# EAGLE design ComponentTester (EAGLE 9.6.2)
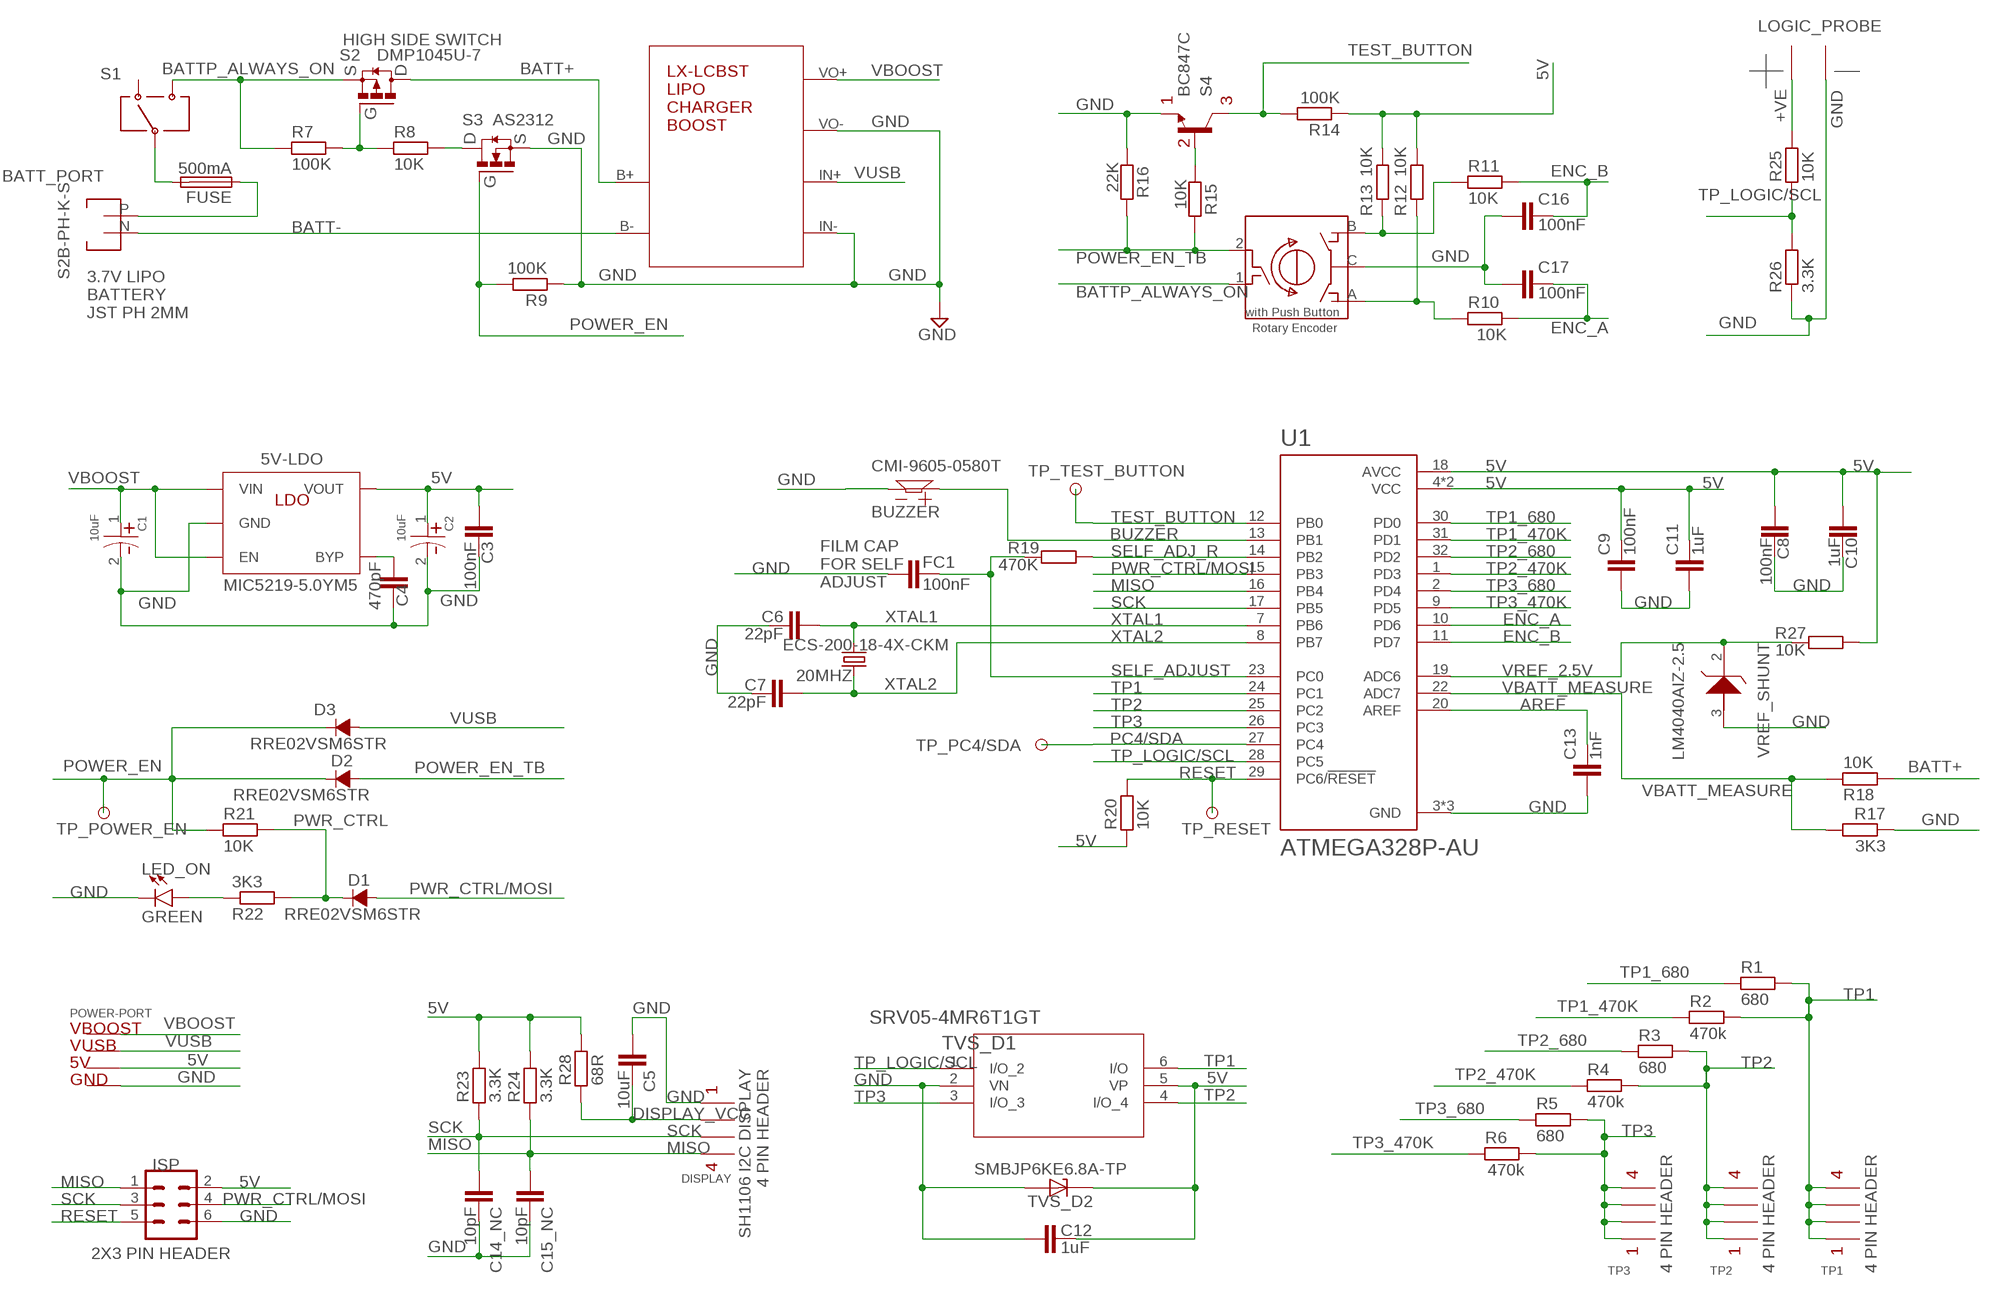
[diagram p0: schematic, sheet 1]

## Parts
5V-LDO  MIC5219-5.0YM5  [SOT-23-5]
20MHZ  ECS-200-18-4X-CKM  [XTAL_ECS-200-18-4X-CKM]
BATT_PORT  S2B-PH-K-S  [S2B-PH-K-S]
BUZZER  CMI-9605-0580T  BUZZER_CMI-9605-0580T  [BUZZER_CMI-9605-0580T]
C1  10uF  CAPACITOR_TANTALUM_SMD1206  [1206_DIRECTED]
C2  10uF  CAPACITOR_TANTALUM_SMD1206  [1206_DIRECTED]
C3  100nF  CAPACITOR_SMD0603  [0603]
C4  470pF  CAPACITOR_SMD0603  [0603]
C5  10uF  CAPACITOR_SMD0603  [0603]
C6  22pF  CAPACITOR_SMD0603  [0603]
C7  22pF  CAPACITOR_SMD0603  [0603]
C8  100nF  CAPACITOR_SMD1206  [1206]
C9  100nF  CAPACITOR_SMD1206  [1206]
C10  1uF  CAPACITOR_SMD1206  [1206]
C11  1uF  CAPACITOR_SMD1206  [1206]
C12  1uF  CAPACITOR_SMD0603  [0603]
C13  1nF  CAPACITOR_SMD0603  [0603]
C14_NC  10pF  CAPACITOR_SMD0603  [0603]
C15_NC  10pF  CAPACITOR_SMD0603  [0603]
C16  100nF  CAPACITOR_SMD0603  [0603]
C17  100nF  CAPACITOR_SMD0603  [0603]
CHARGE_BOOST  LX-LCBST_LIPO_CHARGER_BOOST  [LX-LCBST_LIPO_CHARGER_BOOST]
D1  RRE02VSM6STR  RRE02VSM6S  [TUMD2SM-2]
D2  RRE02VSM6STR  RRE02VSM6S  [TUMD2SM-2]
D3  RRE02VSM6STR  RRE02VSM6S  [TUMD2SM-2]
DISPLAY  SH1106_I2C_DISPLAY  [SH1106_1.3IN_I2C_DISPLAY]
ENC  PEC12R-3217F-S0024-ND  PEC12R-3217F-S0024  [PEC12R-3217F-S0024]
FC1  100nF  CAPACITOR_SMD0805  [0805]
FUSE  500mA  FUSE  [1206]
ISP  2X3 PIN HEADER  ISP_HEADER  [ISP_HEADER]
LED_ON  GREEN  LED1206  [1206_DIODE]
LOGIC_PROBE  5MM_PIN_HEADER  [5MM_PIN_HEADER]
POWER-PORT  POWER_OUT_4_PIN_HEADER  [POWER_OUT_4_PIN_HEADER]
R1  680  RESISTOR_SMD1206  [1206]
R2  470k  RESISTOR_SMD1206  [1206]
R3  680  RESISTOR_SMD1206  [1206]
R4  470k  RESISTOR_SMD1206  [1206]
R5  680  RESISTOR_SMD1206  [1206]
R6  470k  RESISTOR_SMD1206  [1206]
R7  100K  RESISTOR_SMD0603  [0603]
R8  10K  RESISTOR_SMD0603  [0603]
R9  100K  RESISTOR_SMD0603  [0603]
R10  10K  RESISTOR_SMD0603  [0603]
R11  10K  RESISTOR_SMD0603  [0603]
R12  10K  RESISTOR_SMD0603  [0603]
R13  10K  RESISTOR_SMD0603  [0603]
R14  100K  RESISTOR_SMD0603  [0603]
R15  10K  RESISTOR_SMD0603  [0603]
R16  22K  RESISTOR_SMD0603  [0603]
R17  3K3  RESISTOR_SMD0603  [0603]
R18  10K  RESISTOR_SMD0603  [0603]
R19  470K  RESISTOR_SMD0603  [0603]
R20  10K  RESISTOR_SMD0603  [0603]
R21  10K  RESISTOR_SMD0603  [0603]
R22  3K3  RESISTOR_SMD0603  [0603]
R23  3.3K  RESISTOR_SMD0603  [0603]
R24  3.3K  RESISTOR_SMD0603  [0603]
R25  10K  RESISTOR_SMD1206  [1206]
R26  3.3K  RESISTOR_SMD1206  [1206]
R27  10K  RESISTOR_SMD0603  [0603]
R28  68R  RESISTOR_SMD0603  [0603]
S1  SLW-913535-2A-RA-D  [SLW-913535-2A-RA-D]
S2  DMP1045U-7  PMOSFET  [SOT-23-3]
S3  AS2312  G6N02L  [SOT-23-3]
S4  BC847C  [SOT-23-3]
TP1  4_PIN_HEADER  [4_PIN_HEADER]
TP2  4_PIN_HEADER  [4_PIN_HEADER]
TP3  4_PIN_HEADER  [4_PIN_HEADER]
TP_PC4/SDA  TEST_POINT  [TEST_POINT]
TP_POWER_EN  TEST_POINT  [TEST_POINT]
TP_RESET  TEST_POINT  [TEST_POINT]
TP_TEST_BUTTON  TEST_POINT  [TEST_POINT]
TVS_D1  SRV05-4MR6T1GT  SRV05-4MR6T1GTSOP6_3P1X1P7_ONS  [TSOP6_3P1X1P7_ONS]
TVS_D2  SMBJP6KE6.8A-TP  [DIOM5336X244N]
U1  ATMEGA328P-AU  [QFP80P900X900X120-32N]
VREF_SHUNT  LM4040AIZ-2.5  LM4040AIZ-2.5/NOPB  [TO92-3]

## Nets
5V: 5V-LDO.5(VOUT) C2.1(P) C3.2 C8.2 C9.1 C10.2 C11.1 C12.1 ISP.2 POWER-PORT.5V R12.2 R13.2 R14.1 R20.1 R23.2 R24.2 R27.1 R28.2 TVS_D1.5(VP) TVS_D2.C U1.4(VCC) U1.6(VCC) U1.18(AVCC)
+VE: LOGIC_PROBE.P$1 R25.2
AREF: C13.1 U1.20(AREF)
BATT+: CHARGE_BOOST.B+ R18.2 S2.3(D)
BATT+_PORT: BATT_PORT.P FUSE.1
BATT-: BATT_PORT.N CHARGE_BOOST.B-
BATTP_ALWAYS_ON: ENC.1 R7.1 S1.3 S2.2(S)
BUZZER: BUZZER.P$1 U1.13(PB1)
BYP: 5V-LDO.4(BYP) C4.2
DISPLAY_VCC: C5.1 DISPLAY.VCC R28.1
ENC_A: C17.1 R10.2 U1.10(PD6)
ENC_B: C16.1 R11.2 U1.11(PD7)
FUSE_2_SWITCH: FUSE.2 S1.2
GND: 5V-LDO.2(GND) BUZZER.P$2 C1.2(N) C2.2(N) C3.1 C4.1 C5.2 C6.1 C7.1 C8.1 C9.2 C10.1 C11.2 C12.2 C13.2 C14_NC.1 C15_NC.1 C16.2 C17.2 CHARGE_BOOST.IN-(USB-) CHARGE_BOOST.VO- DISPLAY.GND ENC.C FC1.1 ISP.6 LED_ON.C LOGIC_PROBE.P$2 POWER-PORT.GND R9.1 R16.1 R17.1 R26.1 S3.2(S) S4.2(E) TVS_D1.2(VN) TVS_D2.A U1.3(GND) U1.5(GND) U1.21(GND) VREF_SHUNT.3(A)
MISO: C15_NC.2 DISPLAY.SDA ISP.1 R24.1 U1.16(PB4)
N$1: ENC.B R11.1 R13.1
N$4: ENC.A R10.1 R12.1
N$5: R15.1 S4.1(B)
NMOS_DRAIN: R8.2 S3.3(D)
PC4/SDA: TP_PC4/SDA.P$1 U1.27(PC4)
PMOS_GATE: R7.2 R8.1 S2.1(G)
POWER_EN: D2.C D3.C R9.2 R21.1 S3.1(G) TP_POWER_EN.P$1
POWER_EN_TB: D2.A ENC.2 R15.2 R16.2
PWR_CTRL: D1.C R21.2 R22.2
PWR_CTRL/MOSI: D1.A ISP.4 U1.15(PB3)
RESET: ISP.5 R20.2 TP_RESET.P$1 U1.29(PC6/!RESET)
SCK: C14_NC.2 DISPLAY.SCK ISP.3 R23.1 U1.17(PB5)
SELF_ADJ_R: R19.1 U1.14(PB2)
SELF_ADJUST: FC1.2 R19.2 U1.23(PC0)
TEST_BUTTON: R14.2 S4.3(C) TP_TEST_BUTTON.P$1 U1.12(PB0)
TO_LED: LED_ON.A R22.1
TP1: R1.2 R2.2 TP1.P$1 TP1.P$2 TP1.P$3 TP1.P$4 TVS_D1.6(I/O) U1.24(PC1)
TP1_470K: R2.1 U1.31(PD1)
TP1_680: R1.1 U1.30(PD0)
TP2: R3.2 R4.2 TP2.P$1 TP2.P$2 TP2.P$3 TP2.P$4 TVS_D1.4(I/O_4) U1.25(PC2)
TP2_470K: R4.1 U1.1(PD3)
TP2_680: R3.1 U1.32(PD2)
TP3: R5.2 R6.2 TP3.P$1 TP3.P$2 TP3.P$3 TP3.P$4 TVS_D1.3(I/O_3) U1.26(PC3)
TP3_470K: R6.1 U1.9(PD5)
TP3_680: R5.1 U1.2(PD4)
TP_LOGIC/SCL: R25.1 R26.2 TVS_D1.1(I/O_2) U1.28(PC5)
VBATT_MEASURE: R17.2 R18.1 U1.22(ADC7)
VBOOST: 5V-LDO.1(VIN) 5V-LDO.3(EN) C1.1(P) CHARGE_BOOST.VO+ POWER-PORT.VBOOST
VREF_2.5V: R27.2 U1.19(ADC6) VREF_SHUNT.2(C)
VUSB: CHARGE_BOOST.IN+(USB+) D3.A POWER-PORT.VUSB
XTAL1: 20MHZ.2 C6.2 U1.7(PB6)
XTAL2: 20MHZ.1 C7.2 U1.8(PB7)
Unconnected: S1.1

## Notes on the sheet
- HIGH SIDE SWITCH
- 3.7V LIPO
  BATTERY
  JST PH 2MM
- FILM CAP
  FOR SELF
  ADJUST

## Library data of the parts
5V-LDO = MyComponents:MIC5219-5.0YM5: 5V ULTRA LOW NOISE LDO 500mA https://www.mouser.com/ProductDetail/Microchip-Technology/MIC5219-5.0YM5-TR; DATASHEET: https://www.mouser.com/datasheet/2/268/mic5219-1082354.pdf
20MHZ = ECS-200-18-4X-CKM:ECS-200-18-4X-CKM; CHECK_PRICES: https://www.snapeda.com/parts/ECS-200-18-4X-CKM/ECS+Inc./view-part/?ref=eda; DESCRIPTION: 20 MHz ±10ppm Crystal 18pF 30 Ohms HC-49/US; DIGIKEY_PART_NUMBER: 50-ECS-200-18-4X-CKM-ND; MF: ECS Inc.; MP: ECS-200-18-4X-CKM; PACKAGE: HC-49US ECS Inc.; PURCHASE-URL: https://www.snapeda.com/api/url_track_click_mouser/?unipart_id=5049327&manufacturer=ECS Inc.&part_name=ECS-200-18-4X-CKM&search_term=ecs-200-18-4x-ckm; SNAPEDA_LINK: https://www.snapeda.com/parts/ECS-200-18-4X-CKM/ECS+Inc./view-part/?ref=snap
BATT_PORT = MyComponents:S2B-PH-K-S: S2B-PH-K-S JST 2 PIN CONNECTOR RIGHT ANGLE https://www.digikey.com/en/products/detail/jst-sales-america-inc/S2B-PH-K-S/926626
BUZZER = MyComponents:BUZZER_CMI-9605-0580T: Active Buzzer WST-0905T https://www.digikey.com/en/products/detail/soberton-inc/WST-0905T/16354847; DATASHEET: https://www.mouser.com/datasheet/2/670/cmi_9605_0580t-1776530.pdf
C1 C2 = MyComponents:CAPACITOR_TANTALUM_SMD: TANTALUM SMD CAPACITOR
C3-C13 C14_NC C15_NC C16 C17 FC1 = MyComponents:CAPACITOR_SMD: capacitor 1206
CHARGE_BOOST = MyComponents:LX-LCBST_LIPO_CHARGER_BOOST: LX-LCBST_LIPO_CHARGER_BOOST https://www.aliexpress.us/item/3256805102704359.html
D1-D3 = MyComponents:RRE02VSM6S: RECTIFIER DIODE https://fscdn.rohm.com/en/products/databook/datasheet/discrete/diode/rectifier/rre02vsm6s.pdf; DATASHEET: https://fscdn.rohm.com/en/products/databook/datasheet/discrete/diode/rectifier/rre02vsm6s.pdf
DISPLAY = MyComponents:SH1106_I2C_DISPLAY: SH1106 I2C DISPLAY https://www.amazon.com/dp/B0C3L54TL6
ENC = MyComponents:PEC12R-3217F-S0024: Rotary Encoder with Bushing Bourns Inc https://www.digikey.com/en/products/detail/bourns-inc/PEC12R-3217F-S0024/6153383
FUSE = MyComponents:FUSE: FUSE SMD 1206 C1F 250
ISP = MyComponents:ISP_HEADER: ISP HEADER 2X3 2.54MM
LED_ON = MyComponents:LED
LOGIC_PROBE = MyComponents:5MM_PIN_HEADER: 5MM 2 PIN HEADER
POWER-PORT = MyComponents:POWER_OUT_4_PIN_HEADER
R1-R28 = MyComponents:RESISTOR_SMD: resistor smd
S1 = MyComponents:SLW-913535-2A-RA-D: spdt slide switch
S2 = MyComponents:PMOSFET: PMOSFET SOT-23-3
S3 = MyComponents:G6N02L: AS2312 N-Channel 20 V 6.8A (Ta) 1.2W (Ta) Surface Mount SOT-23 https://www.digikey.com/en/products/detail/anbon-semiconductor-int-l-limited/AS2312/16708465
S4 = MyComponents:BC847C: BC847C Bipolar (BJT) Transistor NPN 45 V 100 mA 300MHz 200 mW Surface Mount SOT-23 https://www.digikey.com/en/products/detail/good-ark-semiconductor/BC847C/18648944
TP1-TP3 = MyComponents:4_PIN_HEADER: 4 PIN HEADER; LOCATION: <enter>
TP_PC4/SDA TP_POWER_EN TP_RESET TP_TEST_BUTTON = MyComponents:TEST_POINT: TEST POINT
TVS_D1 = 2023-09-16_06-39-59_Library:SRV05-4MR6T1G; COPYRIGHT: Copyright (C) 2023 Ultra Librarian. All rights reserved.; MANUFACTURER_PART_NUMBER: SRV05-4MR6T1G; MFR_NAME: onsemi
TVS_D2 = SMBJP6KE6.8A-TP:SMBJP6KE6.8A-TP: SMBJ Series 600 W 6.8 V Uni-Directional Surface Mount TVS Diode - SMB; CHECK_PRICES: https://www.snapeda.com/parts/SMBJP6KE6.8A-TP/Micro+Commercial+Components/view-part/?ref=eda; DESCRIPTION: 10.5V Clamp 58.1A Ipp Tvs Diode Surface Mount DO-214AA (SMBJ); DIGIKEY_PART_NUMBER: SMBJP6KE6.8A-TPMSTR-ND; MF: Micro Commercial; MP: SMBJP6KE6.8A-TP; PACKAGE: DO-214 MCC; PURCHASE-URL: https://www.snapeda.com/api/url_track_click_mouser/?unipart_id=577204&manufacturer=Micro Commercial&part_name=SMBJP6KE6.8A-TP&search_term=smbjp6ke6.8a; SNAPEDA_LINK: https://www.snapeda.com/parts/SMBJP6KE6.8A-TP/Micro+Commercial+Components/view-part/?ref=snap
U1 = ATMEGA328P-AU:ATMEGA328P-AU: Check availability <https://pricing.snapeda.com/parts/ATMEGA328P-AU/Microchip/view-part?ref=eda>; AVAILABILITY: In Stock; CHECK_PRICES: https://www.snapeda.com/parts/ATMEGA328P-AU/Microchip/view-part/?ref=eda; DESCRIPTION: AVR AVR® ATmega Microcontroller IC 8-Bit 20MHz 32KB (16K x 16) FLASH 32-TQFP (7x7); MF: Microchip; MP: ATMEGA328P-AU; PACKAGE: TQFP-32 Microchip; PRICE: None; PURCHASE-URL: https://www.snapeda.com/api/url_track_click_mouser/?unipart_id=44280&manufacturer=Microchip&part_name=ATMEGA328P-AU&search_term=atmega328p-au; SNAPEDA_LINK: https://www.snapeda.com/parts/ATMEGA328P-AU/Microchip/view-part/?ref=snap
VREF_SHUNT = MyComponents:LM4040AIZ-2.5/NOPB: https://www.digikey.com/en/products/detail/texas-instruments/LM4040AIZ-2-5-NOPB/182334 Shunt Voltage Reference IC Fixed 2.5V V ±0.1% 15 mA TO-92-3

## Net classes
0 default: clearance 0.205 mm

## Board
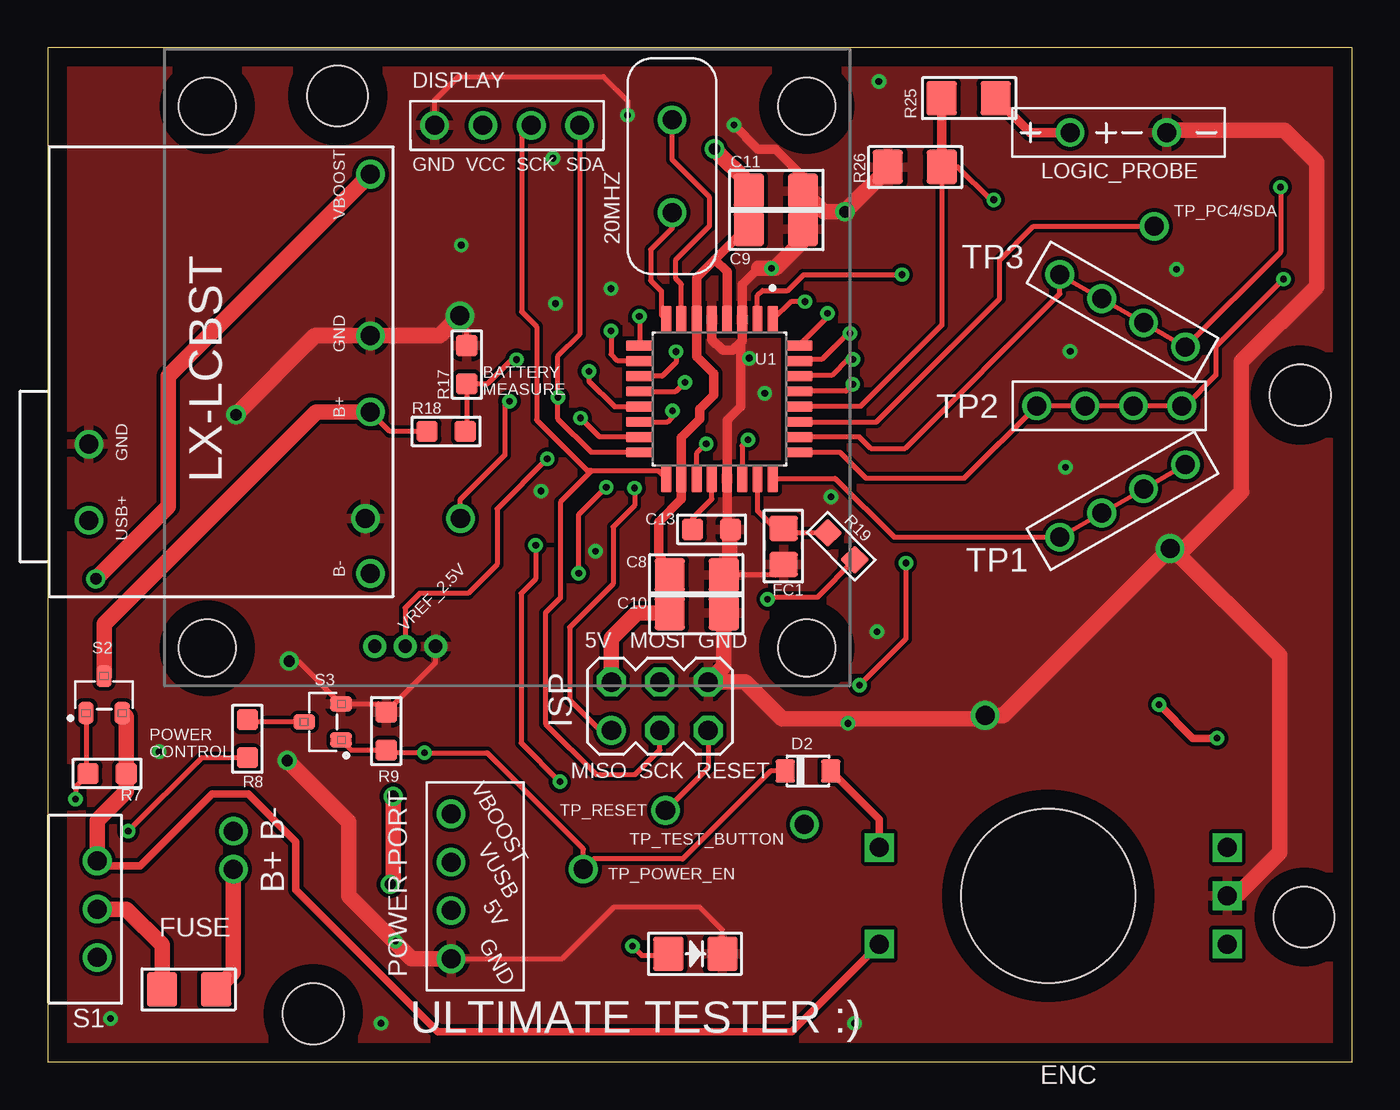
[diagram p1: board, top side]
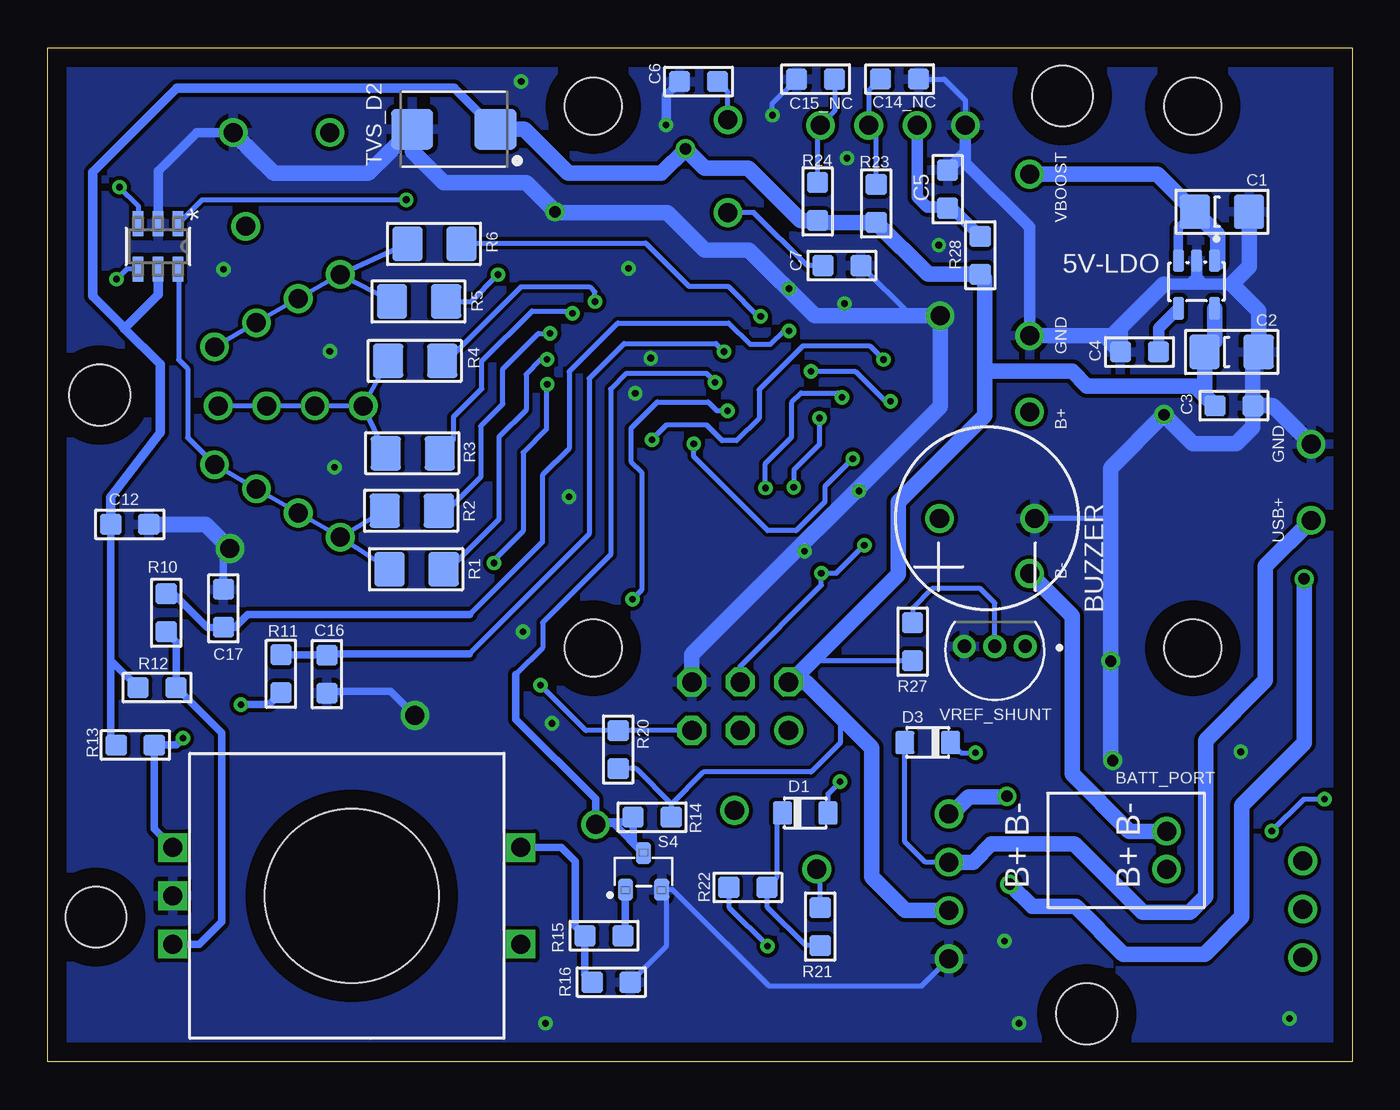
[diagram p2: board, bottom side, seen from below]

Size 68.58 x 53.34 mm. Coordinates in mm from the lower left corner, seen from the top.
Outline: 0,0 68.58,0 68.58,53.34 0,53.34 0,0
Copper layers (1*16): Top 0.035mm / dielectric 1.5mm / Bottom 0.035mm
Design rules "default *": minimum track width 6mil, minimum drill 0.35mm, track to track 0.2mm, track to pad 0.2mm, pad to pad 0.2mm, via to via 0.2mm, smd to smd 6mil, copper to edge 1mm, drill to drill 0.5mm, minimum pad ring 10mil, minimum via ring 8mil, stop-mask expansion 4mil, vias tented up to drill 0mil, thermal gap 10mil
Holes 3.2 mm at 13.97,2.54 66.04,7.62 65.84,35.06 15.24,50.8

### Footprints (pad centres in the part's own frame; a part is rotated, then mirrored left to right if it is on the bottom)
SOT-23-5 = smd 1.21 x 0.59: 1 -1.065,0.95; 2 -1.065,0; 3 -1.065,-0.95; 4 1.445,-0.95; 5 1.445,0.95
XTAL_ECS-200-18-4X-CKM = drill 1: 1 -2.44,0; 2 2.44,0
S2B-PH-K-S = drill 1: N 0.984,-2.54; P -1.016,-2.54
BUZZER_CMI-9605-0580T = drill 1: P$1 0,2.5; P$2 0,-2.5
1206_DIRECTED = smd 1.6 x 1.803: 1 -1.422,0; 2 1.422,0
0603 = smd 1.1 x 1.1: 1 -1,0; 2 1,0
1206 = smd 1.6 x 1.803: 1 -1.422,0; 2 1.422,0
LX-LCBST_LIPO_CHARGER_BOOST = drill 1: B+ -1.73,-7.69; B- -10.23,-7.69; IN+ -7.43,7.11; IN- -3.43,7.11; VO+ 10.77,-7.69; VO- 2.27,-7.69
TUMD2SM-2 = smd 1.2 x 1: A 0,-1.2; C 0,1.2
SH1106_1.3IN_I2C_DISPLAY = drill 1: GND -3.81,-3.81; SCK 1.27,-3.81; SDA 3.81,-3.81; VCC -1.27,-3.81 | hole 3: -15.75,-2.8; -15.75,-31.3; 15.75,-2.8; 15.75,-31.3
PEC12R-3217F-S0024 = drill 1 square: 1 -2.54,8.89; 2 2.54,8.89; A -2.54,-9.398; B 2.54,-9.398; C 0,-9.398 | hole 9.144: 0,0
0805 = smd 1.3 x 1.5: 1 -0.95,0; 2 0.95,0
ISP_HEADER = drill 1.016: 1 -2.54,-1.27 | drill 1.016 octagon: 2 -2.54,1.27; 3 0,-1.27; 4 0,1.27; 5 2.54,-1.27; 6 2.54,1.27
1206_DIODE = smd 1.6 x 1.803: A 1.422,0; C -1.422,0
5MM_PIN_HEADER = drill 1: P$1 -2.54,0; P$2 2.54,0
POWER_OUT_4_PIN_HEADER = drill 1: 5V 1.27,0; GND 3.81,0; VBOOST -3.81,0; VUSB -1.27,0
SLW-913535-2A-RA-D = drill 1: 1 -2.54,0; 2 0,0; 3 2.54,0
SOT-23-3 = smd 0.8 x 1.13: 1 -0.95,-0.96; 2 0.95,-0.96; 3 0,0.96
4_PIN_HEADER = drill 1: P$1 -3.81,0; P$2 -1.27,0; P$3 1.27,0; P$4 3.81,0
TEST_POINT = drill 1: P$1 0,0
TSOP6_3P1X1P7_ONS = smd 1.31 x 0.558: 1 -1.194,1.05; 2 -1.194,0; 3 -1.194,-1.05; 4 1.194,-1.05; 5 1.194,0; 6 1.194,1.05
DIOM5336X244N = smd 2.22 x 2.13: A 2.19,0; C -2.19,0
QFP80P900X900X120-32N = smd 1.47 x 0.55: 1 -4.17,2.8; 2 -4.17,2; 3 -4.17,1.2; 4 -4.17,0.4; 5 -4.17,-0.4; 6 -4.17,-1.2; 7 -4.17,-2; 8 -4.17,-2.8; 17 4.17,-2.8; 18 4.17,-2; 19 4.17,-1.2; 20 4.17,-0.4; 21 4.17,0.4; 22 4.17,1.2; 23 4.17,2; 24 4.17,2.8 | smd 0.55 x 1.47: 9 -2.8,-4.17; 10 -2,-4.17; 11 -1.2,-4.17; 12 -0.4,-4.17; 13 0.4,-4.17; 14 1.2,-4.17; 15 2,-4.17; 16 2.8,-4.17; 25 2.8,4.17; 26 2,4.17; 27 1.2,4.17; 28 0.4,4.17; 29 -0.4,4.17; 30 -1.2,4.17; 31 -2,4.17; 32 -2.8,4.17
TO92-3 = drill 0.7 pad 0.9: 1 -1.6,-0.775; 2 0,-0.775; 3 1.6,-0.775

### Placement (x,y rotation side)
5V-LDO  8.19,41.07 270 bottom
20MHZ  32.82,47.1 90 top
BATT_PORT  12.31,11.15 90 bottom
BUZZER  19.2,28.58 90 bottom
C1  6.86,44.7 0 bottom
C2  6.35,37.34 0 bottom
C3  6.23,34.5 180 bottom
C4  11.19,37.34 0 bottom
C5  21.28,45.89 90 bottom
C6  34.36,51.55 0 bottom
C7  26.83,41.87 180 bottom
C8  34.12,25.6 180 top
C9  38.28,43.8 0 top
C10  34.12,23.6 180 top
C11  38.28,45.8 0 top
C12  64.26,28.27 0 bottom
C13  34.9,28 0 top
C14_NC  23.8,51.68 180 bottom
C15_NC  28.21,51.68 0 bottom
C16  53.9,20.39 270 bottom
C17  59.34,23.85 90 bottom
CHARGE_BOOST  9.28,35.91 90 top
D1  28.76,13.1 90 bottom
D2  39.97,15.3 90 top
D3  22.32,16.8 270 bottom
DISPLAY  24.15,53.06 0 top
ENC  52.6,8.74 90 top
FC1  38.68,27.11 90 top
FUSE  7.44,3.82 180 top
ISP  32.18,18.71 0 top
LED_ON  34.05,5.69 180 top
LOGIC_PROBE  56.28,48.87 0 top
POWER-PORT  21.21,9.24 270 top
R1  49.18,25.91 180 bottom
R2  49.44,28.98 180 bottom
R3  49.39,32.01 180 bottom
R4  49.26,36.86 180 bottom
R5  49.06,39.99 180 bottom
R6  48.24,43.02 180 bottom
R7  3.13,15.16 180 top
R8  10.5,17 90 top
R9  17.8,17.4 270 top
R10  62.34,23.62 90 bottom
R11  56.31,20.41 90 bottom
R12  62.82,19.69 180 bottom
R13  63.97,16.66 180 bottom
R14  36.8,12.87 180 bottom
R15  39.33,6.63 180 bottom
R16  38.96,4.19 180 bottom
R17  22.03,36.67 270 top
R18  20.95,33.16 180 top
R19  41.72,27.12 135 top
R20  38.59,16.43 90 bottom
R21  27.97,7.12 270 bottom
R22  31.78,9.18 0 bottom
R23  25.03,45.15 270 bottom
R24  28.11,45.25 270 bottom
R25  48.41,50.68 0 top
R26  45.58,47.06 0 top
R27  23.11,22.1 90 bottom
R28  19.56,42.42 270 bottom
S1  2.61,8.03 90 top
S2  2.97,19.32 0 top
S3  14.46,17.88 90 top
S4  37.26,10.02 0 bottom
TP1  56.5,29.5 210 top
TP2  55.8,34.5 180 top
TP3  56.5,39.5 150 top
TP_PC4/SDA  58.17,43.94 180 top
TP_POWER_EN  28.16,10.14 0 top
TP_RESET  32.48,13.23 180 top
TP_TEST_BUTTON  39.78,12.48 270 top
TVS_D1  62.77,42.88 270 bottom
TVS_D2  47.23,49.04 180 bottom
U1  35.31,34.86 270 top
VREF_SHUNT  18.8,21.08 180 bottom

### Tracks (layer width: path | path; a pad name or v marks a point on that pad's centre or on a via)
5V  (via drill 0.6)
  Top 0.508: C8.2 32.11,26.71 32.11,28.39 33.31,29.59 U1.18 33.31,32.83 34.29,33.8 34.29,34.34 35,35.05 35,36.19 34.11,37.08 U1.6 34.11,41.24 35.06,42.2 | U1.4 35.72,41.55 35.06,42.2 | C9.1 36.67,43.8 35.06,42.2
  Top 0.813: C8.2 C10.2 30.97,23.6 29.64,22.27 ISP.2 | C9.1 C11.1 36.86,46.2 v35.05,48.01
  Bottom 0.254: R27.1 28.41,21.1 29.53,19.98 ISP.2 28.36,19.98 26.92,18.54 26.92,16.76 28.45,15.24 34.12,15.24 35.8,13.55 R14.1 35.8,13.58 37.65,15.43 R20.1 | 65.26,16.95 R13.2
  Bottom 0.406: R12.2 65.26,21.12 | C12.1 65.26,21.12 | 65.26,21.12 65.26,16.95
  Bottom 0.508: TVS_D2.C 47.2,51.2 61.8,51.2 66.21,46.79 66.21,40.26 64.66,38.71 | TVS_D1.5 62.77,40.34 64.55,38.56 62.67,36.69 62.67,33.09 65.26,29.71 C12.1
  Bottom 0.813: TVS_D2.C 43.52,49.04 41.21,46.74 36.32,46.74 v35.05,48.01 34.04,46.99 31.75,46.99 29.01,44.25 R24.2 28.01,44.15 R23.2 22.3,41.42 R28.2 19.32,41.18 19.32,36.32 | 5V-LDO.5 7.24,37.87 C2.1 7.77,35.04 C3.2 8.27,35.55 13.96,35.55 14.73,36.32 19.32,36.32 | 19.32,36.32 19.32,33.99 23.86,29.45 23.86,25.64 29.53,19.98 28.74,19.98 25.27,16.51 25.27,9.73 23.51,7.97 POWER-PORT.5V
+VE
  Top 0.508: LOGIC_PROBE.P$1 51.64,48.87 R25.2
AREF
  Top 0.254: C13.1 33.9,28.6 34.91,29.61 U1.20
BATT+
  Top 0.254: R18.2 17.99,33.16 CHARGE_BOOST.B+
  Top 0.813: S2.3 2.97,23.04 14.12,34.18 CHARGE_BOOST.B+
BATT+_PORT
  Top 0.813: BATT_PORT.P 9.77,4.73 FUSE.1
BATT-
  Bottom 0.813: BATT_PORT.N 11.73,12.13 14.73,15.14 14.73,23.44 CHARGE_BOOST.B-
BATTP_ALWAYS_ON
  Top 0.254: S1.3 2.87,10.32
  Top 0.406: 2.87,10.32 4.88,10.32 8.66,14.1 10.54,14.1 13.06,11.58 13.06,9.04 20.5,1.6 39.11,1.6 ENC.1
  Top 0.813: S1.3 2.61,12.71 4.13,14.22 R7.1 4.13,18.14 S2.2
BUZZER  (via drill 0.35)
  Top 0.254: v28.45,36.32 28.45,35.81 29.8,34.46 U1.13 | BUZZER.P$1 21.7,29.58 24.03,31.9 24.03,34.49 v24.28,34.75
  Bottom 0.254: v28.45,36.32 26.14,36.32 24.56,34.75 v24.28,34.75
BYP
  Bottom 0.61: 5V-LDO.4 10.19,38.58 C4.2
DISPLAY_VCC
  Bottom 0.61: R28.1 21.03,44.89 C5.1 21.35,44.96 22.35,44.96 22.88,45.49 DISPLAY.VCC
ENC_A  (via drill 0.35)
  Top 0.254: v29.62,38.45 29.62,37.21 29.97,36.86 U1.10
  Bottom 0.254: v29.62,38.45 29.87,38.45 30.59,37.73 31.66,37.73 32.79,38.86 38.61,38.86 41.17,36.3 41.17,32.26 42.58,30.85 42.58,27.34 46.4,23.52 | R10.2 61.95,24.62 | C17.1 58.73,22.85
  Bottom 0.406: 46.4,23.52 58.06,23.52 58.73,22.85 | C17.1 60.19,22.85 61.95,24.62
ENC_B  (via drill 0.35)
  Top 0.254: v33.03,37.35 33.03,36.8 32.3,36.06 U1.11
  Bottom 0.254: 53.92,21.41 C16.1 53.83,21.46 | 46.43,21.46 40.12,27.77 40.12,35.94 38.28,37.79 33.46,37.79 v33.03,37.35
  Bottom 0.406: R11.2 53.92,21.41 | 53.83,21.46 46.43,21.46
FUSE_2_SWITCH
  Top 0.813: FUSE.2 6.02,6.15 4.14,8.03 S1.2
GND  (via drill 0.35, 0.6, 1)
  Top 0.254: FC1.1 38.27,25.6 C8.1 | v12.7,21.08 13.17,21.08 S3.2 17.37,18.83 R9.1 20.4,21 VREF_SHUNT.3 | R17.1 22.03,38.87 v21.67,39.24 | DISPLAY.GND 20.34,50.57 21.59,51.82 29.21,51.82 30.48,50.55 v30.48,49.78 | LED_ON.C 35.47,6.96 34.3,8.13 29.75,8.13 27.05,5.43 POWER-PORT.GND
  Top 0.508: C9.2 39.7,43.2 | 37.38,41.75 36.51,40.88 U1.3 36.51,37.91 | U1.5 34.91,37.99 35.48,37.42 36.02,37.42 36.42,37.82 36.42,34.47 35.71,33.76 35.71,31.95 35.71,31.96 U1.21 35.71,28.19 C13.2 35.84,27.94 | 35.84,25.9 C8.1 | C11.2 39.7,46.54 38.24,48.01 37.34,48.01 v36.07,49.28
  Top 0.813: 39.7,43.2 38.25,41.75 37.38,41.75 | 35.84,27.94 35.84,25.9 | C8.1 C10.1 35.54,20.81 ISP.6 | LOGIC_PROBE.P$2 58.95,49 65,49 66.7,47.3 66.7,40.78 62.74,36.82 62.74,30 62.76,30 59.76,27 v59,27 | v59,27 50.22,18.22 v49.27,18.22 49.08,18.03 38.61,18.03 36.66,19.98 ISP.6 | v59,27 59.06,27.06 64.75,21.37 64.75,11.02 62.48,8.74 ENC.C | v9.91,34.04 14.05,38.18 CHARGE_BOOST.VO- 20.61,38.18 v21.67,39.24 | v12.6,15.85 15.82,12.62 15.82,8.74 19.14,5.43 POWER-PORT.GND | C9.2 C11.2 40.8,44.7 v41.91,44.7 44.16,46.95 R26.1 | ISP.6 35.16,19.98
  Bottom 0.254: C16.2 53.8,19.49 | 7.62,40.89 8.19,41.47 8.77,40.89 | 12.7,21.34 v12.7,21.08 | 12.7,28.45 12.83,28.58 BUZZER.P$2 | R16.1 36.07,6.08 36.07,8.82 S4.2 35.73,9.06 30.67,4 22.63,4 POWER-PORT.GND | C14_NC.1 21.46,51.68 20.34,50.57 DISPLAY.GND | v21.67,39.24 23.2,39.24 C7.1 | v30.48,49.78 30.48,50.41 C15_NC.1
  Bottom 0.406: 53.8,19.49 50.54,19.49 v49.27,18.22 | C17.2 59.34,26.66 v59,27
  Bottom 0.508: TVS_D1.2 62.77,46.83 60.73,48.87 LOGIC_PROBE.P$2 | v36.07,49.28 36.07,50.84 C6.1
  Bottom 0.61: 6.35,40.89 7.62,40.89 8.38,40.89 | 5V-LDO.2 8.19,41.47 8.19,41.08 8.38,40.89 | 8.38,40.89 9.91,40.89 | C5.2 20.34,47.83 DISPLAY.GND 20.34,47.26 16.97,43.89 CHARGE_BOOST.VO-
  Bottom 0.813: v59,27 60.27,28.27 C12.2 | C1.2 5.44,41.81 6.35,40.89 4.93,39.47 C2.2 5.23,37.03 C3.1 | 12.19,38.61 C4.1 13.04,38.18 CHARGE_BOOST.VO- 12.62,38.18 12.19,38.61 | 12.19,38.61 9.91,40.89 | CHARGE_BOOST.IN- 4.19,34.5 C3.1 | C3.1 5.23,33.38 6.1,32.51 8.38,32.51 v9.91,34.04 12.7,31.24 12.7,28.45 12.7,21.34 | v12.7,21.08 12.7,15.95 v12.6,15.85 | LOGIC_PROBE.P$2 56.69,46.74 51.72,46.74 TVS_D2.A 49.42,47.9 47.75,46.23 43.43,46.23 v41.91,44.7 41.87,44.66 36.01,44.66 34.04,42.7 31.73,42.7 28.27,39.24 v21.67,39.24 21.67,34.47 34.72,21.42 ISP.6
  other vias: 17.53,2.03 3.3,2.29 18.29,6.35 29.62,40.67 21.74,42.95 53.75,37.36 53.49,31.27 59.33,41.68 43.69,51.56 26.7,39.88 38.05,41.73 25.93,30.02 26.57,47.52 41.17,29.72 37.69,35.15 5.87,16.31 42.42,2.03 42.06,17.81 36.88,37.01 28.8,26.85 43.59,22.63
  pour Bottom: 76.2,-2.29 76.2,57.15 76.45,57.4 -6.37,57.4 -7.64,-6.09
  pour Top: -8.13,59.18 -8.13,-6.35 77.98,-6.35 77.98,59.18
MISO  (via drill 0.35)
  Top 0.254: 26.79,34.98 26.79,37.08 27.96,38.25 DISPLAY.SDA | 26.79,34.98 26.79,33.84 28.57,32.06 U1.16 | ISP.1 29.47,17.27 29.21,17.27 27.43,19.05 27.43,22.86 29.72,25.15 29.72,28.13 30.86,29.27 v30.86,30.18 | v26.82,34.95 26.79,34.98
  Bottom 0.254: C15_NC.2 27.21,50 DISPLAY.SDA 28.11,49.1 R24.1 | v26.82,34.95 27.05,35.18 28.98,35.18 29.49,34.67 29.49,32.84 30.86,31.48 v30.86,30.18
N$1  (via drill 0.35)
  Top 0.406: v61.47,17.02 60.2,17.02 v58.42,18.8
  Bottom 0.406: ENC.B 62.97,12.25 R13.1 61.82,16.66 v61.47,17.02 | v58.42,18.8 56.93,18.8 R11.1
N$4
  Bottom 0.406: R10.1 61.82,22.1 R12.1 59.44,17.3 59.44,7.37 60.6,6.2 ENC.A
N$5
  Bottom 0.254: R15.1 38.21,6.76
  Bottom 0.406: 38.21,6.76 S4.1
NMOS_DRAIN
  Top 0.254: R8.2 10.62,17.88 S3.3
PC4/SDA
  Top 0.254: U1.27 43.57,33.66 50.04,40.13 50.04,42.16 51.82,43.94 TP_PC4/SDA.P$1
PMOS_GATE  (via drill 0.35)
  Top 0.254: S2.1 2.02,15.27 R7.2 1.47,14.5 v1.47,13.82 | R8.1 8.1,16 v4.24,12.14
  Bottom 0.254: v1.47,13.82 2.56,13.82 v4.24,12.14
POWER_EN  (via drill 0.35)
  Top 0.254: 17.53,16.4 15.95,16.4 S3.1 | 17.53,16.4 R9.2 | D2.C 38,15.3 33.37,10.67 28.68,10.67 TP_POWER_EN.P$1 28.16,11.2 23.1,16.26 v19.81,16.26 17.67,16.26 17.53,16.4
  Bottom 0.254: D3.C 20.58,16.26 v19.81,16.26 | R21.1 27.97,9.96 TP_POWER_EN.P$1
POWER_EN_TB
  Top 0.406: D2.A 43.71,12.76 ENC.2
  Bottom 0.406: R16.2 40.34,4.57 R15.2 40.84,7.14 40.84,10.55 41.57,11.28 ENC.2
PWR_CTRL
  Bottom 0.254: D1.C 30.27,12.79 30.27,9.69 R22.2 30.78,8.17 28.73,6.12 R21.2
PWR_CTRL/MOSI  (via drill 0.35)
  Top 0.254: U1.15 29.01,32.86 v28.02,33.86 | v29.36,30.23 27.91,28.78 v27.91,25.7 | v25.65,27.18 25.65,25.4 24.89,24.64 24.89,16.76 v26.92,14.73
  Bottom 0.254: v28.02,33.86 28.02,32.46 29.36,31.11 v29.36,30.23 | ISP.4 32.18,20.81 27.91,25.07 v27.91,25.7 27.13,25.7 v25.65,27.18 | D1.A 27.56,14.1 v26.92,14.73
RESET  (via drill 0.35)
  Top 0.254: v42.32,35.62 41.96,35.27 U1.29 | v45.11,26.24 45.11,22.25 v42.67,19.81 | ISP.5 34.72,15.47 TP_RESET.P$1
  Bottom 0.254: v42.32,35.62 42.37,35.57 42.37,33.27 43.59,32.05 43.59,27.91 45.11,26.39 v45.11,26.24 | ISP.5 38.58,17.44 R20.2 40.29,17.43 v42.67,19.81
SCK
  Top 0.254: DISPLAY.SCK 24.91,48.74 24.91,39.45 25.7,38.66 25.7,33.76 28.36,31.1 28.6,31.1 | U1.17 32.1,31.1 28.6,31.1 | 28.6,31.1 26.95,29.44 26.95,24.41 26.16,23.62 26.16,17.78 28.83,15.11 30.89,15.11 32.18,16.4 ISP.3
  Bottom 0.254: C14_NC.2 25.42,51.06 DISPLAY.SCK 25.03,48.86 R23.1
SELF_ADJ_R  (via drill 0.35)
  Top 0.254: v37.84,24.33 37.95,24.43 40.45,24.43 R19.1 | U1.14 32.59,33.66 32.84,33.92 v32.84,34.25
  Bottom 0.254: v32.84,34.25 33.4,34.25 33.86,34.7 36.53,34.7 37.92,33.31 37.92,31.57 37.36,31.01 37.36,24.81 v37.84,24.33
SELF_ADJUST
  Top 0.254: U1.23 37.31,28.99 38.24,28.06 FC1.2 38.69,27.82 R19.2
TEST_BUTTON  (via drill 0.35)
  Top 0.254: v33.49,35.73 33.02,35.26 U1.12
  Bottom 0.254: v33.49,35.73 33.49,35.75 33.96,36.22 38.15,36.22 38.98,35.39 38.98,26.67 42.55,23.1 42.55,21.78 43.97,20.37 | S4.3 | 38.76,12.48 TP_TEST_BUTTON.P$1 39.64,12.61 | R14.2 38.06,12.61
  Bottom 0.406: R14.2 37.8,11.53 S4.3 | 43.97,20.37 43.97,18.01 39.78,13.82 TP_TEST_BUTTON.P$1 | 38.76,12.48 S4.3 | 39.64,12.61 38.06,12.61
TO_LED  (via drill 0.35)
  Top 0.254: v30.73,6.1 31.24,5.59 32.53,5.59 LED_ON.A
  Bottom 0.254: R22.1 32.78,8.14 v30.73,6.1
TP1
  Top 0.254: TP1.P$1 TP1.P$2 TP1.P$3 TP1.P$4 44.49,27.59 41.39,30.69 U1.24
  Bottom 0.254: TVS_D1.6 61.7,41.66 61.7,36.92 61.22,36.45 61.22,32.83 TP1.P$1 TP1.P$2 TP1.P$3 TP1.P$4 | TP1.P$4 R2.2 | TP1.P$4 R1.2
TP1_470K  (via drill 0.35)
  Top 0.254: v42.18,38.3 42.05,38.3 40.68,36.94 39.56,36.94 U1.31
  Bottom 0.254: R2.1 47.59,28.98 45.81,30.75 45.81,33.43 44.65,34.59 44.65,36.44 42.78,38.3 v42.18,38.3
TP1_680  (via drill 0.35)
  Top 0.254: v42.34,36.95 42.06,36.95 41.21,36.1 39.52,36.1 U1.30
  Bottom 0.254: R1.1 47.48,25.91 44.86,28.53 44.86,32.87 43.43,34.29 43.43,36.15 42.64,36.95 v42.34,36.95
TP2  (via drill 0.35)
  Top 0.254: v64.95,41.16 61.4,37.61 61.4,36.11 59.79,34.5 TP2.P$1 TP2.P$2 TP2.P$3 TP2.P$4 48.18,30.69 43.01,30.69 41.64,32.06 U1.25
  Bottom 0.254: v64.95,41.16 64.42,41.69 TVS_D1.4 | TP2.P$4 TP2.P$3 TP2.P$2 TP2.P$1 | R3.2 TP2.P$4 | TP2.P$4 R4.2
TP2_470K  (via drill 0.35)
  Top 0.254: v39.81,39.98 39.08,39.98 38.13,39.03 U1.1
  Bottom 0.254: R4.1 47.59,36.86 43.69,40.77 40.09,40.77 39.81,40.49 v39.81,39.98
TP2_680  (via drill 0.35)
  Top 0.254: v40.99,39.36 40.99,39.17 U1.32
  Bottom 0.254: R3.1 47.25,32.72 47.25,33.9 45.76,35.4 45.76,36.85 43.12,39.49 41.11,39.49 v40.99,39.36
TP3  (via drill 0.35)
  Top 0.254: v64.8,46 64.8,42.59 TP3.P$1 TP3.P$2 TP3.P$3 TP3.P$4 53.2,40.39 45.07,32.26 43.27,32.26 42.67,32.86 U1.26
  Bottom 0.254: R5.2 TP3.P$4 | v64.8,46 63.82,45.02 TVS_D1.3 | TP3.P$4 TP3.P$3 TP3.P$2 TP3.P$1 | R6.2 TP3.P$4
TP3_470K  (via drill 0.35)
  Top 0.254: U1.9 31.14,39.16 v31.1,39.2
  Bottom 0.254: v31.1,39.2 31.22,39.2 32.81,40.79 34.87,40.79 37.15,43.07 46.77,43.07 R6.1
TP3_680  (via drill 0.35)
  Top 0.254: U1.2 37.31,40.31 37.57,40.57 38.91,40.57 39.72,41.38 44.88,41.38 v44.9,41.4
  Bottom 0.254: v44.9,41.4 v44.91,41.4 46.31,39.99 R5.1
TP_LOGIC/SCL  (via drill 0.35)
  Top 0.254: v49.73,45.34 49.57,45.34 47.85,47.06 R26.2 47,41 47,38.75 42.72,34.47 U1.28
  Top 0.508: R25.1 47,50.67 R26.2
  Bottom 0.254: TVS_D1.1 60.46,45.34 v49.73,45.34
VBATT_MEASURE  (via drill 0.35)
  Top 0.254: R18.1 22.03,33.24 R17.2 23.12,35.67 24.39,36.93 v24.64,36.93 | v36.82,32.72 36.51,32.41 U1.22
  Bottom 0.254: v24.64,36.93 25.38,37.67 28.87,37.67 31.19,35.35 31.19,33.84 32.36,32.66 33.12,32.66 33.93,33.48 36.07,33.48 v36.82,32.72
VBOOST  (via drill 0.6)
  Top 0.813: CHARGE_BOOST.VO+ 6.35,36.06 6.35,29.21 v2.54,25.4 | v18.01,9.35 18.16,9.5 v18.16,13.97
  Bottom 0.406: 5V-LDO.1 7.15,42.04 7.09,42.04
  Bottom 0.508: C1.1 9.14,43.84 5V-LDO.3
  Bottom 0.813: CHARGE_BOOST.VO+ 10.26,46.68 C1.1 7.09,43.51 7.09,42.04 | v2.54,25.4 2.54,16.76 5.82,13.49 5.82,7.62 7.77,5.66 12.04,5.66 14.55,8.18 16.84,8.18 v18.01,9.35 | POWER-PORT.VBOOST 21.05,13.05 20.16,13.94 18.2,13.94 v18.16,13.97
VREF_2.5V  (via drill 0.35)
  Top 0.254: U1.19 34.1,31.98 v34.62,32.5 | v26.26,31.73 23.62,29.08 23.62,26.16 22.1,24.64 19.56,24.64 18.8,23.88 VREF_SHUNT.2
  Bottom 0.254: VREF_SHUNT.2 18.8,24.13 19.56,24.89 22.1,24.89 23.11,23.88 R27.2 | v26.26,31.73 27.72,30.26 27.72,29.45 29.24,27.94 30.73,27.94 34.62,31.82 v34.62,32.5
VUSB
  Bottom 0.254: POWER-PORT.VUSB 22.44,10.51 23.52,11.58 D3.A
  Bottom 0.813: CHARGE_BOOST.IN+ 4.57,26.08 4.57,20.07 7.72,16.92 7.72,8.71 8.56,7.87 11.02,7.87 14.62,11.47 18.97,11.47 19.94,10.51 POWER-PORT.VUSB
XTAL1
  Top 0.254: U1.7 33.31,40.89 33.02,41.18 33.02,42.19 34.8,43.97 34.8,45.47 32.82,47.44 20MHZ.2
  Bottom 0.254: 20MHZ.2 32.82,51.01 C6.2
XTAL2
  Top 0.254: U1.8 32.26,39.28 32.26,40.54 31.7,41.09 31.7,42.72 32.82,43.84 20MHZ.1
  Bottom 0.254: C7.2 28.67,41.87 31.45,44.66 20MHZ.1

### Text on the board
tPlace: BATTERY / MEASURE | VREF_2.5V | POWER / CONTROL | ULTIMATE TESTER :)
_tPlace: LOGIC_PROBE | PC4/SDA_TP
_bPlace: RESET_TP | TP_POWER_EN | TEST_BUTTON_TP
_tNames: DISPLAY | R25 | R26 | 20MHZ | C11 | C9 | U1 | TP3 | R17 | TP2 | R18 | R19 | TP1 | C13 | C8 | FC1 | C10 | S2 | R21 | S3 | ISP | R7 | R8 | R9 | R20 | POWER-PORT | D3 | D1 | R22 | F1 | S1 | ENC
_bNames: C14_NC | C15_NC | C6 | R23 | R24 | TVS_D2 | C5 | C1 | R6 | R28 | C7 | R5 | 5V-LDO | C2 | R4 | C4 | C3 | R3 | R2 | C12 | R1 | BUZZER | C17 | R10 | C16 | R27 | R13 | VREF_SHUNT | R11 | P1 | R12 | R14 | S4 | R15 | D2 | R16
_bValues: TVS_D1